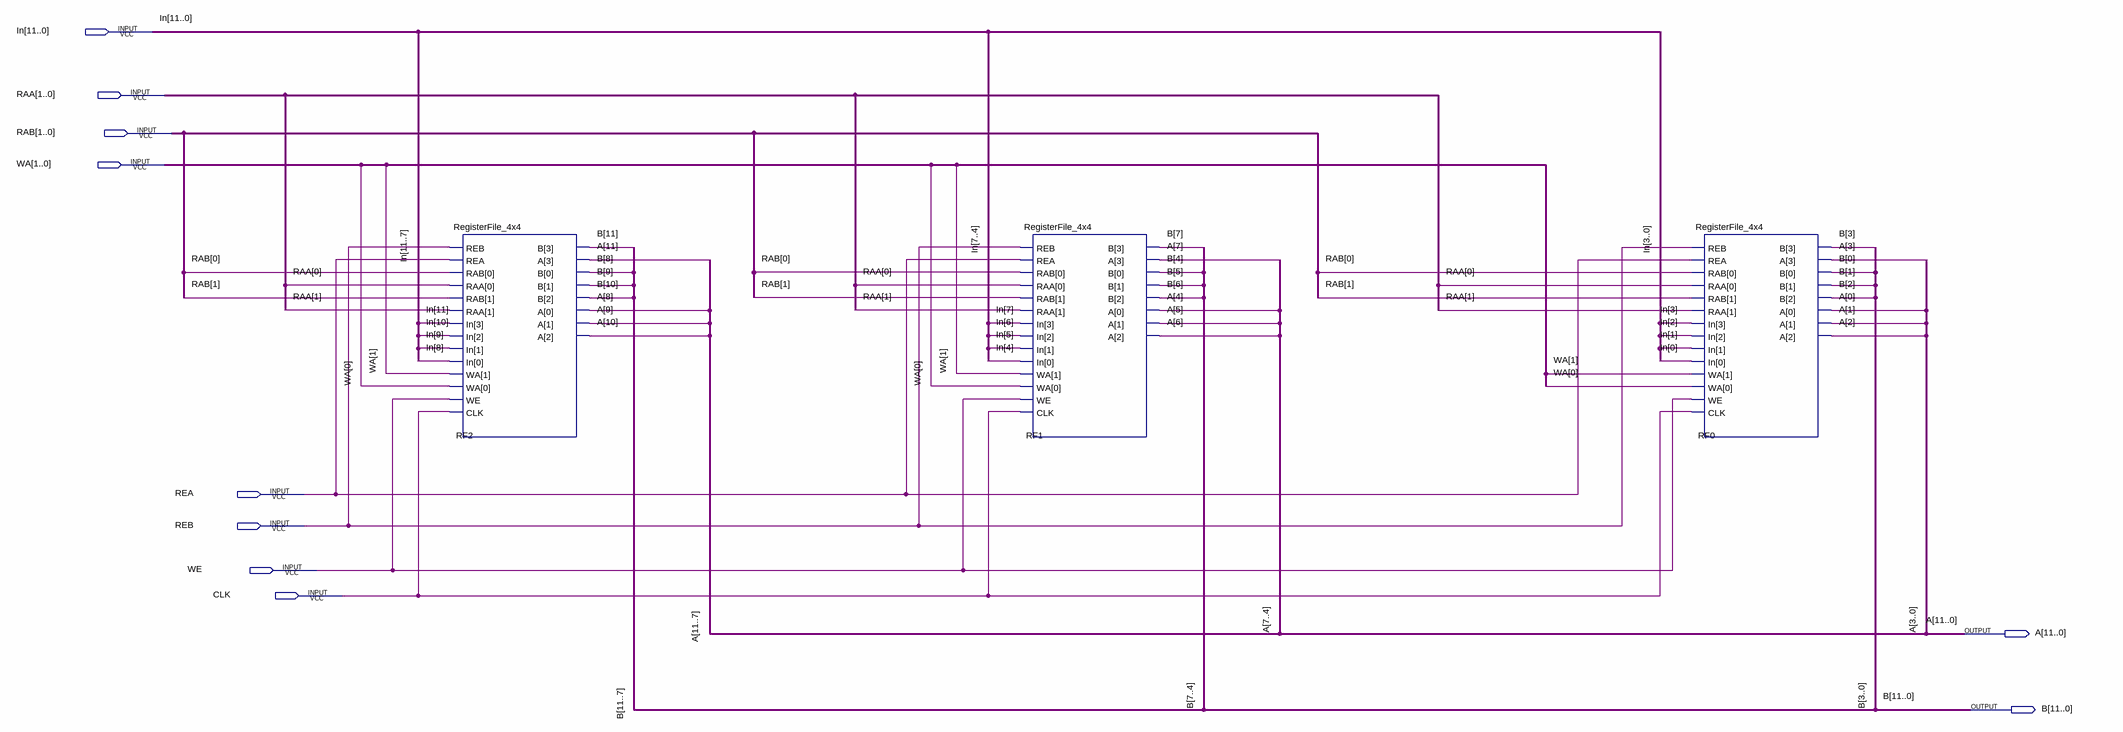
[diagram p0: schematic sheet]
// Quartus schematic RegisterFile_11bit.bdf as structural Verilog: 3 symbols, 10 pins
module RegisterFile_11bit (
  input  [11:0] In,
  input  [1:0] RAA,
  input  [1:0] RAB,
  input  [1:0] WA,
  input  REA,
  input  REB,
  input  WE,
  input  CLK,
  output [11:0] A,
  output [11:0] B
);

  RegisterFile_4x4 RF2 (
    .REB(REB), .REA(REA), .RAB(RAB), .RAA(RAA), .In(In[11:8]), .WA(WA), .WE(WE), .CLK(CLK), .B(B[11:8]),
    .A(A[11:8]));
  RegisterFile_4x4 RF1 (
    .REB(REB), .REA(REA), .RAB(RAB), .RAA(RAA), .In(In[7:4]), .WA(WA), .WE(WE), .CLK(CLK), .B(B[7:4]),
    .A(A[7:4]));
  RegisterFile_4x4 RF0 (
    .REB(REB), .REA(REA), .RAB(RAB), .RAA(RAA), .In(In[3:0]), .WA(WA), .WE(WE), .CLK(CLK), .B(B[3:0]),
    .A(A[3:0]));
endmodule
